# Altium schematic sheet IN_V.SchDoc
size 420 x 297 mm; Author: ALTIUM GOSTBOM2.0 KEV; SheetNumber: 3; SheetTotal: 3; Наименование_организации: НИТУ МИСИС; п_Разраб_Р: Хрущев А.С.
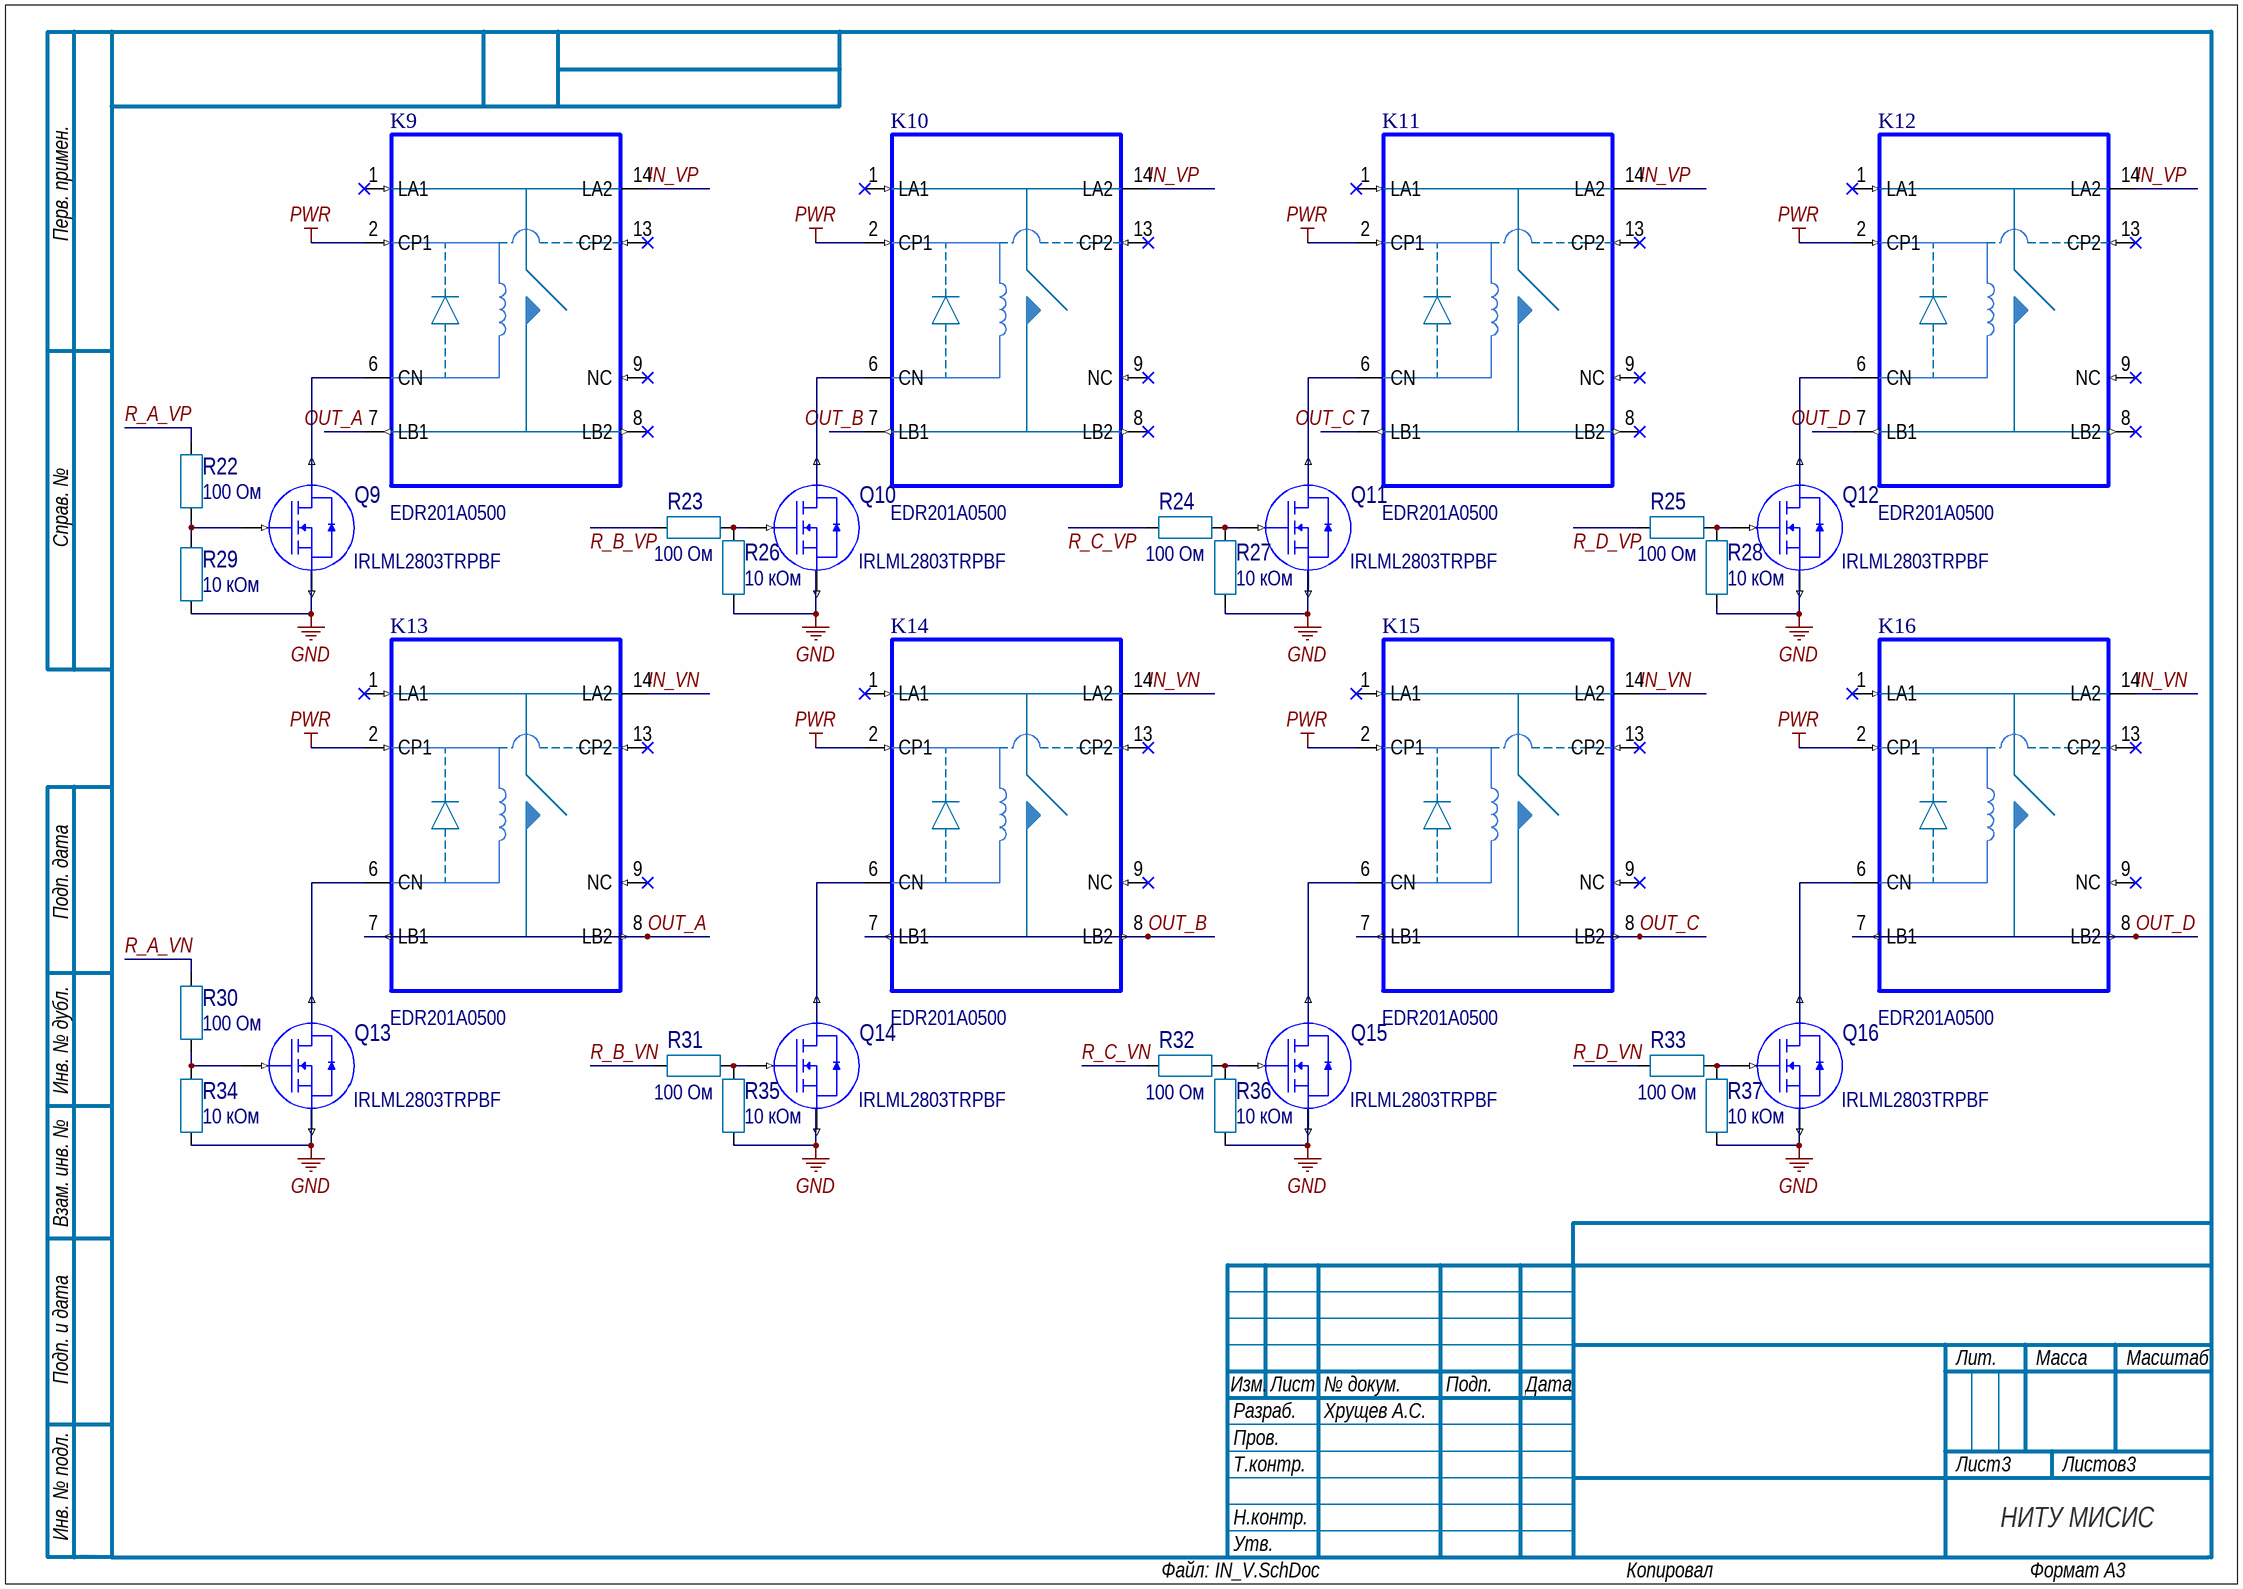
[diagram p0: IN_V.SchDoc]

## Parts
K9  EDR201A0500  [DIP14]
K10  EDR201A0500  [DIP14]
K11  EDR201A0500  [DIP14]
K12  EDR201A0500  [DIP14]
K13  EDR201A0500  [DIP14]
K14  EDR201A0500  [DIP14]
K15  EDR201A0500  [DIP14]
K16  EDR201A0500  [DIP14]
Q9  IRLML2803TRPBF  [SOT23-3]
Q10  IRLML2803TRPBF  [SOT23-3]
Q11  IRLML2803TRPBF  [SOT23-3]
Q12  IRLML2803TRPBF  [SOT23-3]
Q13  IRLML2803TRPBF  [SOT23-3]
Q14  IRLML2803TRPBF  [SOT23-3]
Q15  IRLML2803TRPBF  [SOT23-3]
Q16  IRLML2803TRPBF  [SOT23-3]
R22  100 Ом  [R0805]
R23  100 Ом  [R0805]
R24  100 Ом  [R0805]
R25  100 Ом  [R0805]
R26  10 кОм  [R0805]
R27  10 кОм  [R0805]
R28  10 кОм  [R0805]
R29  10 кОм  [R0805]
R30  100 Ом  [R0805]
R31  100 Ом  [R0805]
R32  100 Ом  [R0805]
R33  100 Ом  [R0805]
R34  10 кОм  [R0805]
R35  10 кОм  [R0805]
R36  10 кОм  [R0805]
R37  10 кОм  [R0805]

## Nets
GND: Q9.2(S) Q10.2(S) Q11.2(S) Q12.2(S) Q13.2(S) Q14.2(S) Q15.2(S) Q16.2(S) R26.1 R27.1 R28.1 R29.1 R34.1 R35.1 R36.1 R37.1
PWR: K9.2(CP1) K10.2(CP1) K11.2(CP1) K12.2(CP1) K13.2(CP1) K14.2(CP1) K15.2(CP1) K16.2(CP1)
IN_VN: K13.14(LA2) K14.14(LA2) K15.14(LA2) K16.14(LA2)
IN_VP: K9.14(LA2) K10.14(LA2) K11.14(LA2) K12.14(LA2)
OUT_A: K9.7(LB1) K13.7(LB1) K13.8(LB2)
OUT_B: K10.7(LB1) K14.7(LB1) K14.8(LB2)
OUT_C: K11.7(LB1) K15.7(LB1) K15.8(LB2)
OUT_D: K12.7(LB1) K16.7(LB1) K16.8(LB2)
R_A_VN: R30.2
R_A_VP: R22.2
R_B_VN: R31.1
R_B_VP: R23.1
R_C_VN: R32.1
R_C_VP: R24.1
R_D_VN: R33.1
R_D_VP: R25.1
NetK9_6: K9.6(CN) Q9.3(D)
NetK10_6: K10.6(CN) Q10.3(D)
NetK11_6: K11.6(CN) Q11.3(D)
NetK12_6: K12.6(CN) Q12.3(D)
NetK13_6: K13.6(CN) Q13.3(D)
NetK14_6: K14.6(CN) Q14.3(D)
NetK15_6: K15.6(CN) Q15.3(D)
NetK16_6: K16.6(CN) Q16.3(D)
NetQ9_1: Q9.1(G) R22.1 R29.2
NetQ10_1: Q10.1(G) R23.2 R26.2
NetQ11_1: Q11.1(G) R24.2 R27.2
NetQ12_1: Q12.1(G) R25.2 R28.2
NetQ13_1: Q13.1(G) R30.1 R34.2
NetQ14_1: Q14.1(G) R31.2 R35.2
NetQ15_1: Q15.1(G) R32.2 R36.2
NetQ16_1: Q16.1(G) R33.2 R37.2

Not connected (* = marked no-connect by the designer): K9 1(LA1)* 8(LB2)* 9(NC)* 13(CP2)*; K10 1(LA1)* 8(LB2)* 9(NC)* 13(CP2)*; K11 1(LA1)* 8(LB2)* 9(NC)* 13(CP2)*; K12 1(LA1)* 8(LB2)* 9(NC)* 13(CP2)*; K13 1(LA1)* 9(NC)* 13(CP2)*; K14 1(LA1)* 9(NC)* 13(CP2)*; K15 1(LA1)* 9(NC)* 13(CP2)*; K16 1(LA1)* 9(NC)* 13(CP2)*

## Notes on the sheet
- Перв. примен.
- Справ. №
- Подп. дата
- Инв. № дубл.
- Взам. инв. №
- Подп. и дата
- Изм.
- Разраб.
- Лист
- № докум.
- Подп.
- Дата
- Лит.
- Масса
- Масштаб
- Пров.
- Т.контр.
- Листов
- Инв. № подл.
- Н.контр.
- Утв.
- ALTIUM GOSTBOM2.0 KEV
- Файл:
- Копировал
- Формат А3

## Library data of the parts
K9-K16 = EDR201A0500: Реле герконовое 5V / 1A,100V; MF: Fairchild Semiconductor; MP: MM74HC32N; SnapEDA_Link: https://www.snapeda.com/parts/MM74HC32N/Fairchild+Imaging/view-part/?ref=snap; Package: DIP-14 Fairchild Semiconductor; Value: *; Check_prices: https://www.snapeda.com/parts/MM74HC32N/Fairchild+Imaging/view-part/?ref=eda
Q9-Q16 = IRLML2803TRPBF: N-MOSFET 30V 1.2A SOT23; Supplier 1: Future Electronics; Supplier Part Number 1: 1173882
R22-R25 R30-R33 = R1_POSTOYANNYJ: Резистор 100 Ом; Value: 100 Ом
R26-R29 R34-R37 = R1_POSTOYANNYJ: Резистор 100 Ом; Value: 100 Ом